# Altium schematic sheet P07_IO SWITCH_JTAG_MICRO SD.SchDoc
size A3
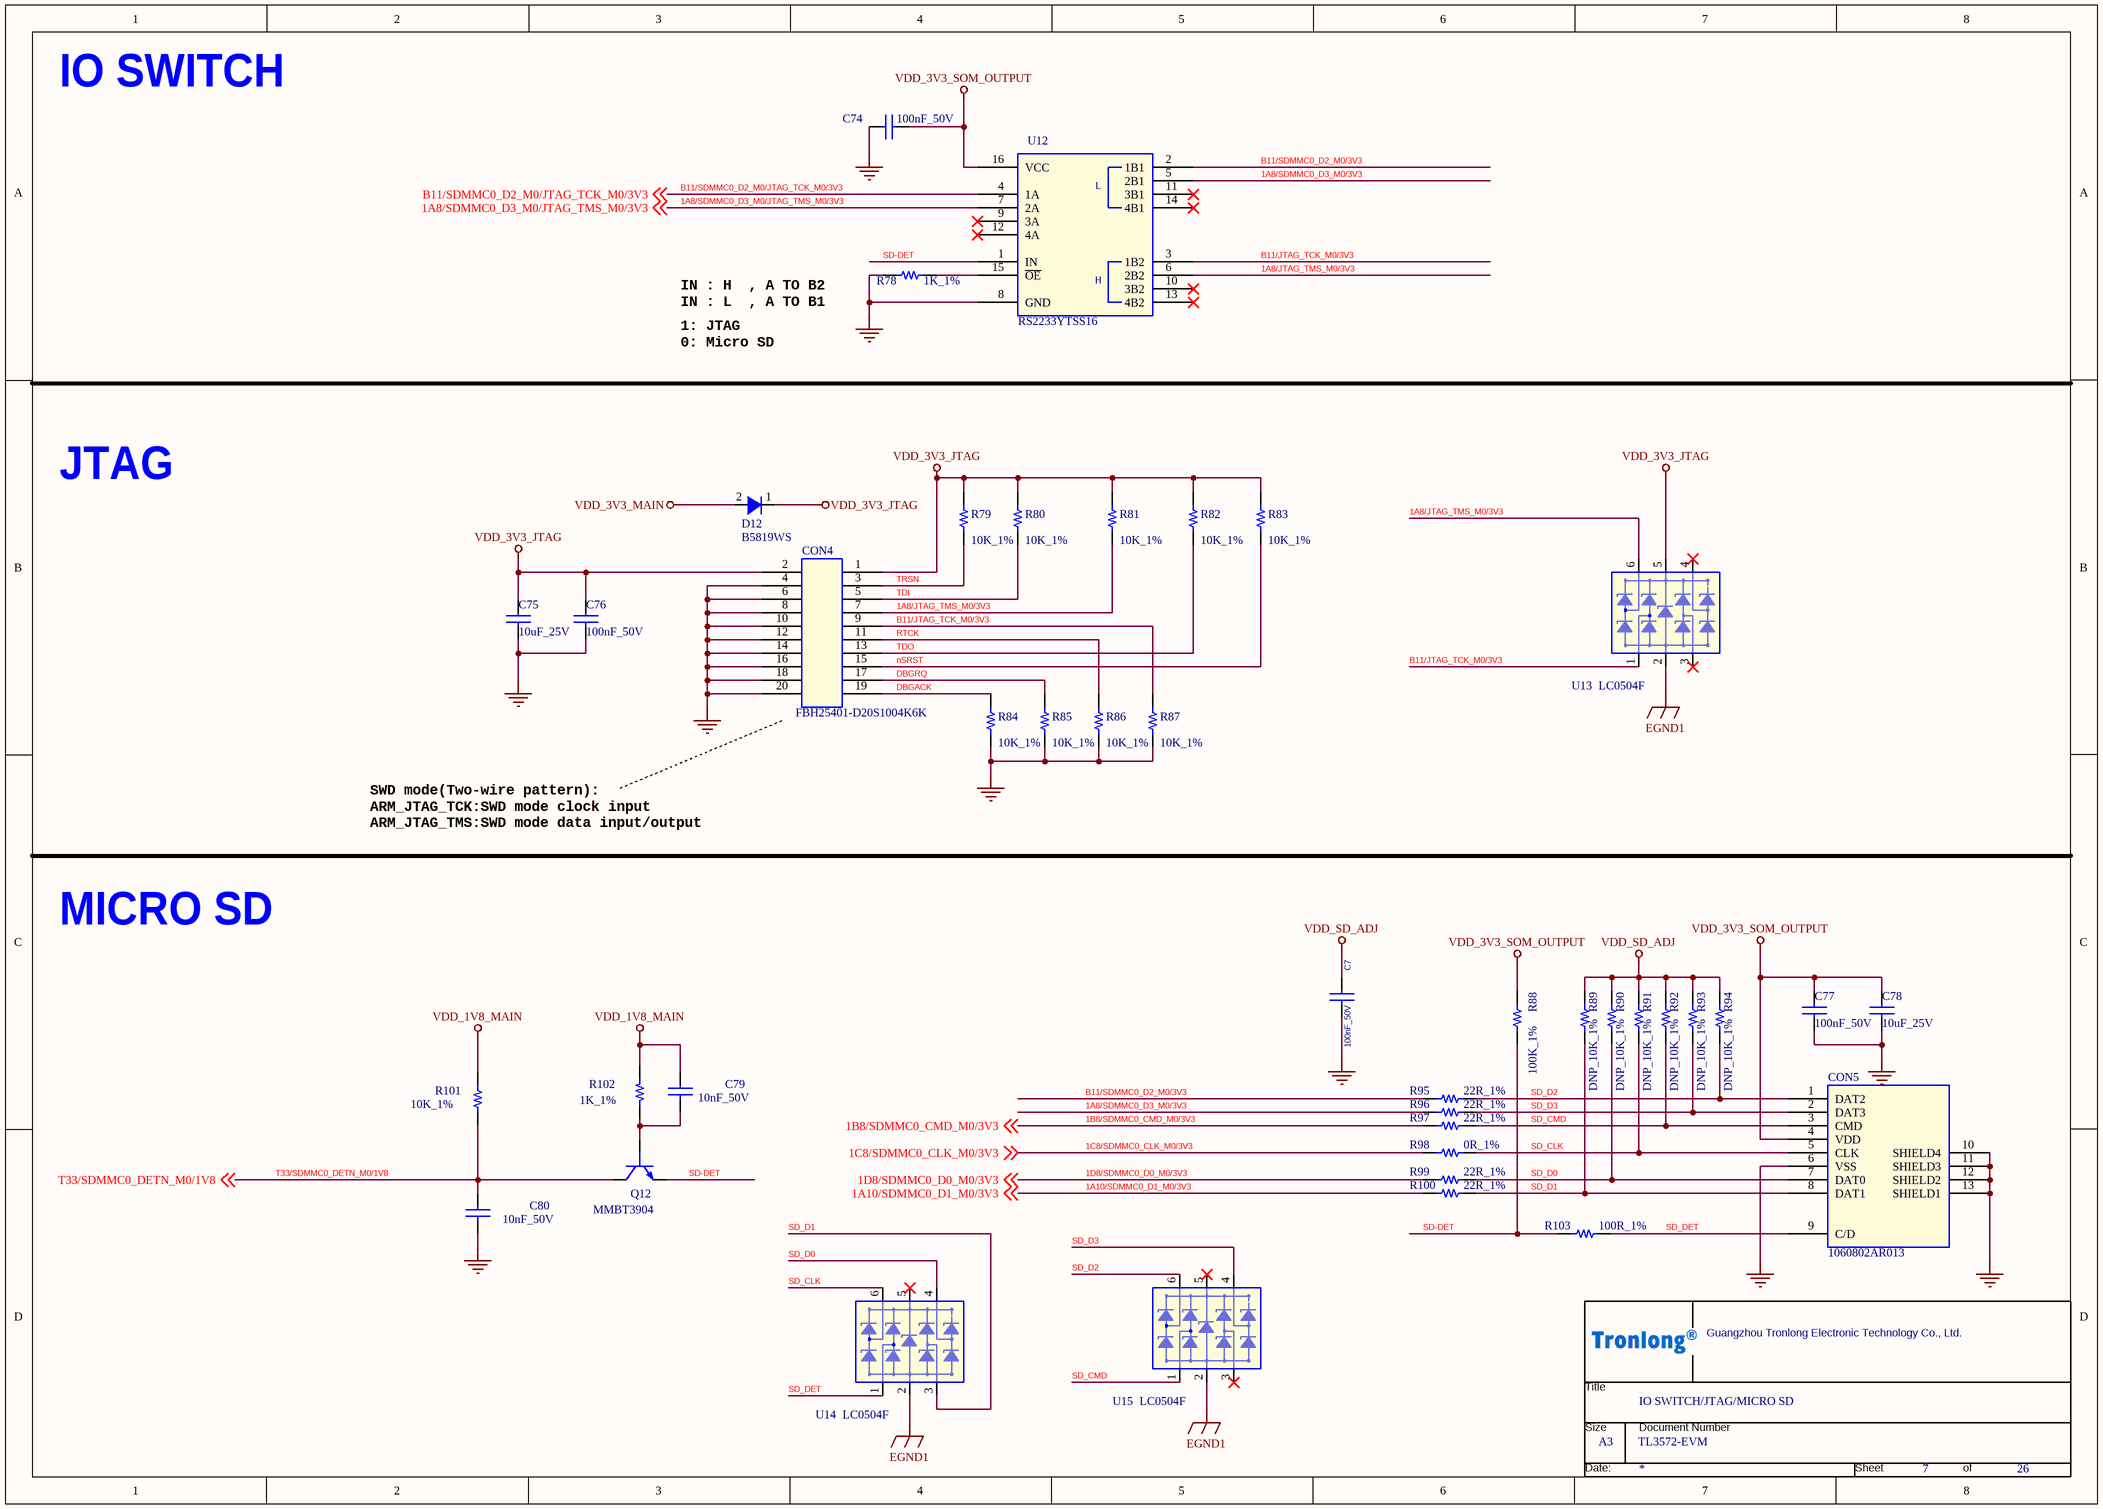
[diagram p0: P07_IO SWITCH_JTAG_MICRO SD.SchDoc]

## Parts
*  Page Count: 26  Page Number: 7  Page Size: A3  OrgName: Guangzhou Tronlong Electronic Technology Co., Ltd.  Title: IO SWITCH/JTAG/MICRO SD  Doc: TL3572-EVM  (hidden comment: TL_NEW)  (graphical)
C7  100nF_50V  [C0402]
C74  100nF_50V  [C0402]
C75  10uF_25V  [C0603]
C76  100nF_50V  [C0402]
C77  100nF_50V  [C0402]
C78  10uF_25V  [C0603]
C79  10nF_50V  [C0402]
C80  10nF_50V  [C0402]
CON4  FBH25401-D20S1004K6K  [con_2d54_2x10_th_box_90]
CON5  1060802AR013  [CON_TF_CARD]
D12  B5819WS  [SOD-323]
Q12  MMBT3904  [SOT23-3_DBZ3]
R78  1K_1%  [R0603]
R79  10K_1%  [R0402]
R80  10K_1%  [R0402]
R81  10K_1%  [R0402]
R82  10K_1%  [R0402]
R83  10K_1%  [R0402]
R84  10K_1%  [R0402]
R85  10K_1%  [R0402]
R86  10K_1%  [R0402]
R87  10K_1%  [R0402]
R88  100K_1%  [R0402]
R89  DNP_10K_1%  [R0402]
R90  DNP_10K_1%  [R0402]
R91  DNP_10K_1%  [R0402]
R92  DNP_10K_1%  [R0402]
R93  DNP_10K_1%  [R0402]
R94  DNP_10K_1%  [R0402]
R95  22R_1%  [R0402]
R96  22R_1%  [R0402]
R97  22R_1%  [R0402]
R98  0R_1%  [R0402]
R99  22R_1%  [R0402]
R100  22R_1%  [R0402]
R101  10K_1%  [R0402]
R102  1K_1%  [R0603]
R103  100R_1%  [R0402]
U12  RS2233YTSS16  [TSSOP16]
U13  LC0504F  [SOT363]
U14  LC0504F  [SOT363]
U15  LC0504F  [SOT363]

## Nets
EGND1: U13.2 U14.2 U15.2
GND: C7.2 C74.1 C75.2 C76.2 C77.2 C78.2 C80.2 CON4.4 CON4.6 CON4.8 CON4.10 CON4.12 CON4.14 CON4.16 CON4.18 CON4.20 CON5.6(VSS) CON5.10(SHIELD4) CON5.11(SHIELD3) CON5.12(SHIELD2) CON5.13(SHIELD1) R78.2 R84.2 R85.2 R86.2 R87.2 U12.8(GND)
VDD_1V8_MAIN: C79.1 R101.1 R102.1
VDD_3V3_JTAG: C75.1 C76.1 CON4.1 CON4.2 D12.1(Anode) R79.1 R80.1 R81.1 R82.1 R83.1 U13.5
VDD_3V3_MAIN: D12.2(Cathode)
VDD_3V3_SOM_OUTPUT: C74.2 C77.1 C78.1 CON5.4(VDD) R88.1 U12.16(VCC)
VDD_SD_ADJ: C7.1 R89.1 R90.1 R91.1 R92.1 R93.1 R94.1
1A8/JTAG_TMS_M0/3V3: CON4.7 R81.2 U12.6(2B2) U13.6
1A8/SDMMC0_D3_M0/3V3: R96.1 U12.5(2B1)
1A8/SDMMC0_D3_M0/JTAG_TMS_M0/3V3: U12.7(2A) ; off-sheet 1A8/SDMMC0_D3_M0/JTAG_TMS_M0/3V3
1A10/SDMMC0_D1_M0/3V3: R100.1 ; off-sheet 1A10/SDMMC0_D1_M0/3V3
1B8/SDMMC0_CMD_M0/3V3: R97.1 ; off-sheet 1B8/SDMMC0_CMD_M0/3V3
1C8/SDMMC0_CLK_M0/3V3: R98.1 ; off-sheet 1C8/SDMMC0_CLK_M0/3V3
1D8/SDMMC0_D0_M0/3V3: R99.1 ; off-sheet 1D8/SDMMC0_D0_M0/3V3
B11/JTAG_TCK_M0/3V3: CON4.9 R87.1 U12.3(1B2) U13.1
B11/SDMMC0_D2_M0/3V3: R95.1 U12.2(1B1)
B11/SDMMC0_D2_M0/JTAG_TCK_M0/3V3: U12.4(1A) ; off-sheet B11/SDMMC0_D2_M0/JTAG_TCK_M0/3V3
DBGACK: CON4.19 R84.1
DBGRQ: CON4.17 R85.1
nSRST: CON4.15 R83.2
RTCK: CON4.11 R86.1
SD-DET: Q12.2(E) R88.2 R103.1 U12.1(IN)
SD_CLK: CON5.5(CLK) R91.2 R98.2 U14.6
SD_CMD: CON5.3(CMD) R92.2 R97.2 U15.1
SD_D0: CON5.7(DAT0) R90.2 R99.2 U14.4
SD_D1: CON5.8(DAT1) R89.2 R100.2 U14.3
SD_D2: CON5.1(DAT2) R94.2 R95.2 U15.6
SD_D3: CON5.2(DAT3) R93.2 R96.2 U15.4
SD_DET: CON5.9(C/D) R103.2 U14.1
T33/SDMMC0_DETN_M0/1V8: C80.1 Q12.3(C) R101.2 ; off-sheet T33/SDMMC0_DETN_M0/1V8
TDI: CON4.5 R80.2
TDO: CON4.13 R82.2
TRSN: CON4.3 R79.2
NetC79_2: C79.2 Q12.1(B) R102.2
NetR78_1: R78.1 U12.15(~{OE})

Not connected (* = marked no-connect by the designer): U12 9(3A)* 10(3B2)* 11(3B1)* 12(4A)* 13(4B2)* 14(4B1)*; U13 3* 4*; U14 5*; U15 3* 5*

## Notes on the sheet
- IO SWITCH
- (near R78) IN : H  , A TO B2
  IN : L  , A TO B1
- 1: JTAG
  0: Micro SD
- JTAG
- SWD mode(Two-wire pattern):
  ARM_JTAG_TCK:SWD mode clock input
  ARM_JTAG_TMS:SWD mode data input/output
- MICRO SD
- (in symbol TL_NEW) Title; Size; Document Number; Date:; Sheet; of
- (in symbol TS3A5018DR_2) L; H

## Library data of the parts
* = TL_NEW: RevCode: A?; Page Create Date: March  8, 1995; Page Modify Date: *; Document: TL3572-EVM
C7 = CAP NP_Dup2: 贴片陶瓷电容,100nF,10%,50V,X7R; Manufacturer PartNumber: 0402B104K500NT; Manufacturer: 广东风华高新科技股份有限公司（FH）; Manufacturer Character: 中国大陆; Eco-Label: ROHS; ERP Number: 005.0001.0001.00681; As-Welded: /; Operation Temperature（℃）: -55~+125(Ta); Part Status: 试用; Temperature: -55~125℃; PCB Footprint: C0402
C74 = CAP NP_Dup2: 贴片陶瓷电容,100nF,10%,50V,X7R; Manufacturer: 广东风华高新科技股份有限公司（FH）; Manufacturer PartNumber: 0402B104K500NT; Manufacturer Character: 中国大陆; As-Welded: /; Operation Temperature（℃）: -55~+125(Ta); ERP Number: 005.0001.0001.00681; Eco-Label: ROHS; Temperature: -55~155℃; Part Status: 试用; PCB Footprint: C0402
C75 = CAP NP_Dup2: 贴片陶瓷电容,10uF,20%,25V,X5R; Manufacturer Character: 中国大陆; Manufacturer PartNumber: 0603X106M250NT; Manufacturer: 广东风华高新科技股份有限公司（FH）; Eco-Label: ROHS; ERP Number: 005.0001.0001.00527; As-Welded: /; Operation Temperature（℃）: -55~+85(Ta); Part Status: 优选; Temperature: -55~125℃; PCB Footprint: C0603
C76 = CAP NP_Dup2: 贴片陶瓷电容,100nF,10%,50V,X7R; Manufacturer: 广东风华高新科技股份有限公司（FH）; Manufacturer PartNumber: 0402B104K500NT; Manufacturer Character: 中国大陆; Eco-Label: ROHS; ERP Number: 005.0001.0001.00681; Operation Temperature（℃）: -55~+125(Ta); As-Welded: /; Part Status: 试用; Temperature: -55~125℃; PCB Footprint: C0402
C77 = CAP NP_Dup2: 贴片陶瓷电容,100nF,10%,50V,X7R; Manufacturer Character: 中国大陆; Manufacturer: 广东风华高新科技股份有限公司（FH）; Manufacturer PartNumber: 0402B104K500NT; Operation Temperature（℃）: -55~+125(Ta); As-Welded: /; ERP Number: 005.0001.0001.00681; Eco-Label: ROHS; Part Status: 试用; Temperature: -55~125℃; PCB Footprint: C0402
C78 = CAP NP_Dup2: 贴片陶瓷电容,10uF,20%,25V,X5R; Manufacturer Character: 中国大陆; Manufacturer PartNumber: 0603X106M250NT; Manufacturer: 广东风华高新科技股份有限公司（FH）; Eco-Label: ROHS; ERP Number: 005.0001.0001.00527; Operation Temperature（℃）: -55~+85(Ta); As-Welded: /; Temperature: -55~125℃; Part Status: 优选; PCB Footprint: C0603
C79 C80 = CAP NP_Dup3: 贴片陶瓷电容,10nF,10%,50V,X7R; Manufacturer Character: 中国大陆; Manufacturer PartNumber: 0402B103K500NT; Manufacturer: 广东风华高新科技股份有限公司（FH）; Eco-Label: ROHS; ERP Number: 005.0001.0001.00522; Operation Temperature（℃）: -55~+125(Ta); As-Welded: /; Part Status: 优选; PCB Footprint: C0402
CON4 = CON20A: 简易牛角座,2x10P,2.54mm,公座,黑色,180度; Manufacturer Character: 中国大陆; Manufacturer: 深圳特思嘉工业电子有限公司（TXGA）; Eco-Label: ROHS; ERP Number: 005.0001.0003.00591; Operation Temperature（℃）: -40~+105(Ta); As-Welded: /; Part Status: 试用; Manufacturer PartNumber: FBH25401-D20S1004K6K; PCB Footprint: con_2d54_2x10_th_box_90
CON5 = PROCONN SDC009-52-D_3: Micro SD卡座,9P,自弹,贴片; Manufacturer: 广州高炬电子科技有限公司（gorchi）; Manufacturer Character: 中国大陆; As-Welded: /; Operation Temperature（℃）: -40~+85(Ta); ERP Number: 005.0001.0003.00383; Eco-Label: ROHS; Part Status: 优选; Manufacturer PartNumber: 1060802AR013; Temperature: -40~85℃; PCB Footprint: CON_TF_CARD
D12 = Diode200mA250V_2: 肖特基二极管,VR=40V,IF=1A,VF=0.6V@1A; Mfr: On Semiconductor; MfrNum: MMSD103T1G; TIIntPartnumber: 1E0013; Manufacturer Character: 中国大陆; Manufacturer: 江苏长晶科技股份有限公司（JSCJ）; Descriptive_Text: Diode 200mA 250V 1.25V Forward Drop; Vendor: Digikey; Cost100: 0.23; Cost10K: 0.07; PCB Footprint: smd123; Eco-Label: ROHS; ERP Number: 005.0001.0010.00093; As-Welded: /; Operation Temperature（℃）: -55~+125(Tj); PartName: Diode200mA250V; DescriptiveText: Diode 200mA 250V 1.25V Forward Drop; Part Status: 优选; Temperature: -40~125℃; Manufacturer PartNumber: B5819WS
Q12 = MMBT3904/SOT: BJT,NPN,Vceo=40V,Ic=200mA,fT=300MHz,PD=200mW; Manufacturer: 江苏长晶科技股份有限公司（JSCJ）; Manufacturer Character: 中国大陆; Operation Temperature（℃）: -55~+150(Tj); As-Welded: /; ERP Number: 005.0001.0008.00002; Eco-Label: ROHS; Part Status: 优选; Manufacturer PartNumber: MMBT3904; Temperature: -55~150℃; PCB Footprint: SOT23-3_DBZ3
R78 = Resistor_Dup3: 贴片电阻,1K,±1%,1/10W; Manufacturer: 广东风华高新科技股份有限公司（FH）; Manufacturer PartNumber: RS-03K1001FT; Manufacturer Character: 中国大陆; CLASS: DISCRETE; Eco-Label: ROHS; ERP Number: 005.0001.0002.00961; As-Welded: /; Operation Temperature（℃）: -55~+155(Ta); room: JTAG_DSP; Part Status: 优选; PCB Footprint: R0603
R79 R85 = Resistor_Dup3: 贴片电阻,10K,±1%,1/16W; Manufacturer Character: 中国大陆; Manufacturer: 广东风华高新科技股份有限公司（FH）; Manufacturer PartNumber: RC-02K1002FT; CLASS: DISCRETE; As-Welded: /; Operation Temperature（℃）: -55~+125(Ta); room: 485-5; ERP Number: 005.0001.0002.01326; Eco-Label: ROHS; Temperature: -55~155℃; Part Status: 优选; PCB Footprint: R0402
R80 R81 R86 R87 = Resistor_Dup3: 贴片电阻,10K,±1%,1/16W; Manufacturer PartNumber: RC-02K1002FT; Manufacturer: 广东风华高新科技股份有限公司（FH）; Manufacturer Character: 中国大陆; CLASS: DISCRETE; Eco-Label: ROHS; ERP Number: 005.0001.0002.01326; room: 485-5; Operation Temperature（℃）: -55~+125(Ta); As-Welded: /; Part Status: 优选; Temperature: -55~155℃; PCB Footprint: R0402
R82 = Resistor_Dup3: 贴片电阻,10K,±1%,1/16W; Manufacturer Character: 中国大陆; Manufacturer PartNumber: RC-02K1002FT; Manufacturer: 广东风华高新科技股份有限公司（FH）; CLASS: DISCRETE; As-Welded: /; Operation Temperature（℃）: -55~+125(Ta); room: 485-5; ERP Number: 005.0001.0002.01326; Eco-Label: ROHS; Temperature: -55~155℃; Part Status: 优选; PCB Footprint: R0402
R83 = Resistor_Dup3: 贴片电阻,10K,±1%,1/16W; Manufacturer: 广东风华高新科技股份有限公司（FH）; Manufacturer PartNumber: RC-02K1002FT; Manufacturer Character: 中国大陆; CLASS: DISCRETE; Eco-Label: ROHS; ERP Number: 005.0001.0002.01326; room: 485-5; Operation Temperature（℃）: -55~+125(Ta); As-Welded: /; Part Status: 优选; Temperature: -55~155℃; PCB Footprint: R0402
R84 = Resistor_Dup3: 贴片电阻,10K,±1%,1/16W; Manufacturer Character: 中国大陆; Manufacturer: 广东风华高新科技股份有限公司（FH）; Manufacturer PartNumber: RC-02K1002FT; CLASS: DISCRETE; Eco-Label: ROHS; ERP Number: 005.0001.0002.01326; room: 485-5; Operation Temperature（℃）: -55~+125(Ta); As-Welded: /; Part Status: 优选; Temperature: -55~155℃; PCB Footprint: R0402
R88 = Resistor_Dup3: RC0402FR-07100KL,0402WGF1003TCE; Manufacturer PartNumber: 100K,±1%,R0402,≥1/16W; Manufacturer: 广州创龙; CLASS: DISCRETE; As-Welded: /; room: 485-5; Operation Temperature（℃）: -40~+85(Ta); ERP Number: 005.0001.0023.00025; Eco-Label: ROHS; Temperature: -55~155℃; Manufacturer Character: -; Part Status: -; PCB Footprint: R0402
R89-R91 R93 R94 = Resistor_Dup3: 贴片电阻,10K,±1%,1/16W; Manufacturer: 广东风华高新科技股份有限公司（FH）; Manufacturer PartNumber: RC-02K1002FT; Manufacturer Character: 中国大陆; CLASS: DISCRETE; Eco-Label: ROHS; ERP Number: 005.0001.0002.01326; As-Welded: DNP; Operation Temperature（℃）: -55~+125(Ta); Temperature: –55~155℃; Part Status: 优选; PCB Footprint: R0402
R92 = Resistor_Dup3: 贴片电阻,10K,±1%,1/16W; Manufacturer PartNumber: RC-02K1002FT; Manufacturer: 广东风华高新科技股份有限公司（FH）; Manufacturer Character: 中国大陆; CLASS: DISCRETE; Eco-Label: ROHS; ERP Number: 005.0001.0002.01326; As-Welded: DNP; Operation Temperature（℃）: -55~+125(Ta); Temperature: –55~155℃; Part Status: 优选; PCB Footprint: R0402
R95-R97 R100 = Resistor_Dup3: 贴片电阻,22R,±1%,1/16W; Manufacturer Character: 中国大陆; Manufacturer PartNumber: RC-02K22R0FT; Manufacturer: 广东风华高新科技股份有限公司（FH）; CLASS: DISCRETE; Eco-Label: ROHS; ERP Number: 005.0001.0002.01316; Operation Temperature（℃）: -55~+125(Ta); As-Welded: /; Part Status: 试用; Temperature: -55~155℃; PCB Footprint: R0402
R98 = Resistor_Dup3: 贴片电阻,0R,±1%,1/16W; Manufacturer: 广东风华高新科技股份有限公司（FH）; Manufacturer PartNumber: RC-02000FT; Manufacturer Character: 中国大陆; CLASS: DISCRETE; ERP Number: 005.0001.0002.00938; As-Welded: /; Operation Temperature（℃）: -55~+155(Ta); Eco-Label: ROHS; Part Status: 优选; PCB Footprint: R0402
R99 = Resistor_Dup3: 贴片电阻,22R,±1%,1/16W; Manufacturer: 广东风华高新科技股份有限公司（FH）; Manufacturer PartNumber: RC-02K22R0FT; Manufacturer Character: 中国大陆; CLASS: DISCRETE; As-Welded: /; Operation Temperature（℃）: -55~+125(Ta); ERP Number: 005.0001.0002.01316; Eco-Label: ROHS; Part Status: 试用; Temperature: -55~155℃; PCB Footprint: R0402
R101 = Resistor_Dup4: 贴片电阻,10K,±1%,1/16W; Manufacturer: 广东风华高新科技股份有限公司（FH）; Manufacturer PartNumber: RC-02K1002FT; Manufacturer Character: 中国大陆; CLASS: DISCRETE; ERP Number: 005.0001.0002.01326; Operation Temperature（℃）: -55~+125(Ta); As-Welded: /; Eco-Label: ROHS; Part Status: 优选; PCB Footprint: R0402
R102 = Resistor_Dup4: 贴片电阻,1K,±1%,1/10W; Manufacturer PartNumber: RS-03K1001FT; Manufacturer: 广东风华高新科技股份有限公司（FH）; Manufacturer Character: 中国大陆; CLASS: DISCRETE; Operation Temperature（℃）: -55~+155(Ta); As-Welded: /; ERP Number: 005.0001.0002.00961; Eco-Label: ROHS; Part Status: 优选; PCB Footprint: R0603
R103 = Resistor_Dup4: 贴片电阻,100R,±1%,1/16W; Manufacturer: 广东风华高新科技股份有限公司（FH）; Manufacturer PartNumber: RC-02K1000FT; Manufacturer Character: 中国大陆; CLASS: DISCRETE; Eco-Label: ROHS; ERP Number: 005.0001.0002.01314; Operation Temperature（℃）: -55~+155(Ta); As-Welded: /; Temperature: -55~155℃; Part Status: 试用; PCB Footprint: R0402
U12 = TS3A5018DR_2: 4通道模拟开关; Manufacturer: 江苏润石科技有限公司（RUNIC）; Manufacturer Character: 中国大陆; Operation Temperature（℃）: -40~+85(Ta); room: JTAG_DSP; As-Welded: /; ERP Number: 005.0001.0004.00913; Eco-Label: ROHS; Temperature: -40~85℃; Manufacturer PartNumber: RS2233YTSS16; Part Status: 优选; PCB Footprint: TSSOP16
U13 = PRTR5V0U4Y_0: ESD二极管,VRWM=5V,VBR=6V,四组,单向,8KV,15KV; Manufacturer: 上海雷卯电子科技有限公司（Leiditech）; Manufacturer Character: 中国大陆; As-Welded: /; Operation Temperature（℃）: -55~+125(Tj); room: SD; ERP Number: 005.0001.0017.00061; Eco-Label: ROHS; Manufacturer Part Number: PRTR5V0U4Y; Manufacturer PartNumber: LC0504F; Temperature: -55~125℃; Part Status: 优选; PCB Footprint: SOT363
U14 = PRTR5V0U4Y_0: ESD二极管,VRWM=5V,VBR=6V,四组,单向,8KV,15KV; Manufacturer: 上海雷卯电子科技有限公司（Leiditech）; Manufacturer Character: 中国大陆; Eco-Label: ROHS; ERP Number: 005.0001.0017.00061; As-Welded: /; Operation Temperature（℃）: -55~+125(Tj); room: SD; Part Status: 优选; Temperature: -55~125℃; Manufacturer PartNumber: LC0504F; Manufacturer Part Number: PRTR5V0U4Y; PCB Footprint: SOT363
U15 = PRTR5V0U4Y_0: ESD二极管,VRWM=5V,VBR=6V,四组,单向,8KV,15KV; Manufacturer: 上海雷卯电子科技有限公司（Leiditech）; Manufacturer Character: 中国大陆; room: SD; Operation Temperature（℃）: -55~+125(Tj); As-Welded: /; ERP Number: 005.0001.0017.00061; Eco-Label: ROHS; Part Status: 优选; Manufacturer Part Number: PRTR5V0U4Y; Manufacturer PartNumber: LC0504F; Temperature: -55~125℃; PCB Footprint: SOT363